# EAGLE design vewa-filters (EAGLE 6.6.0)
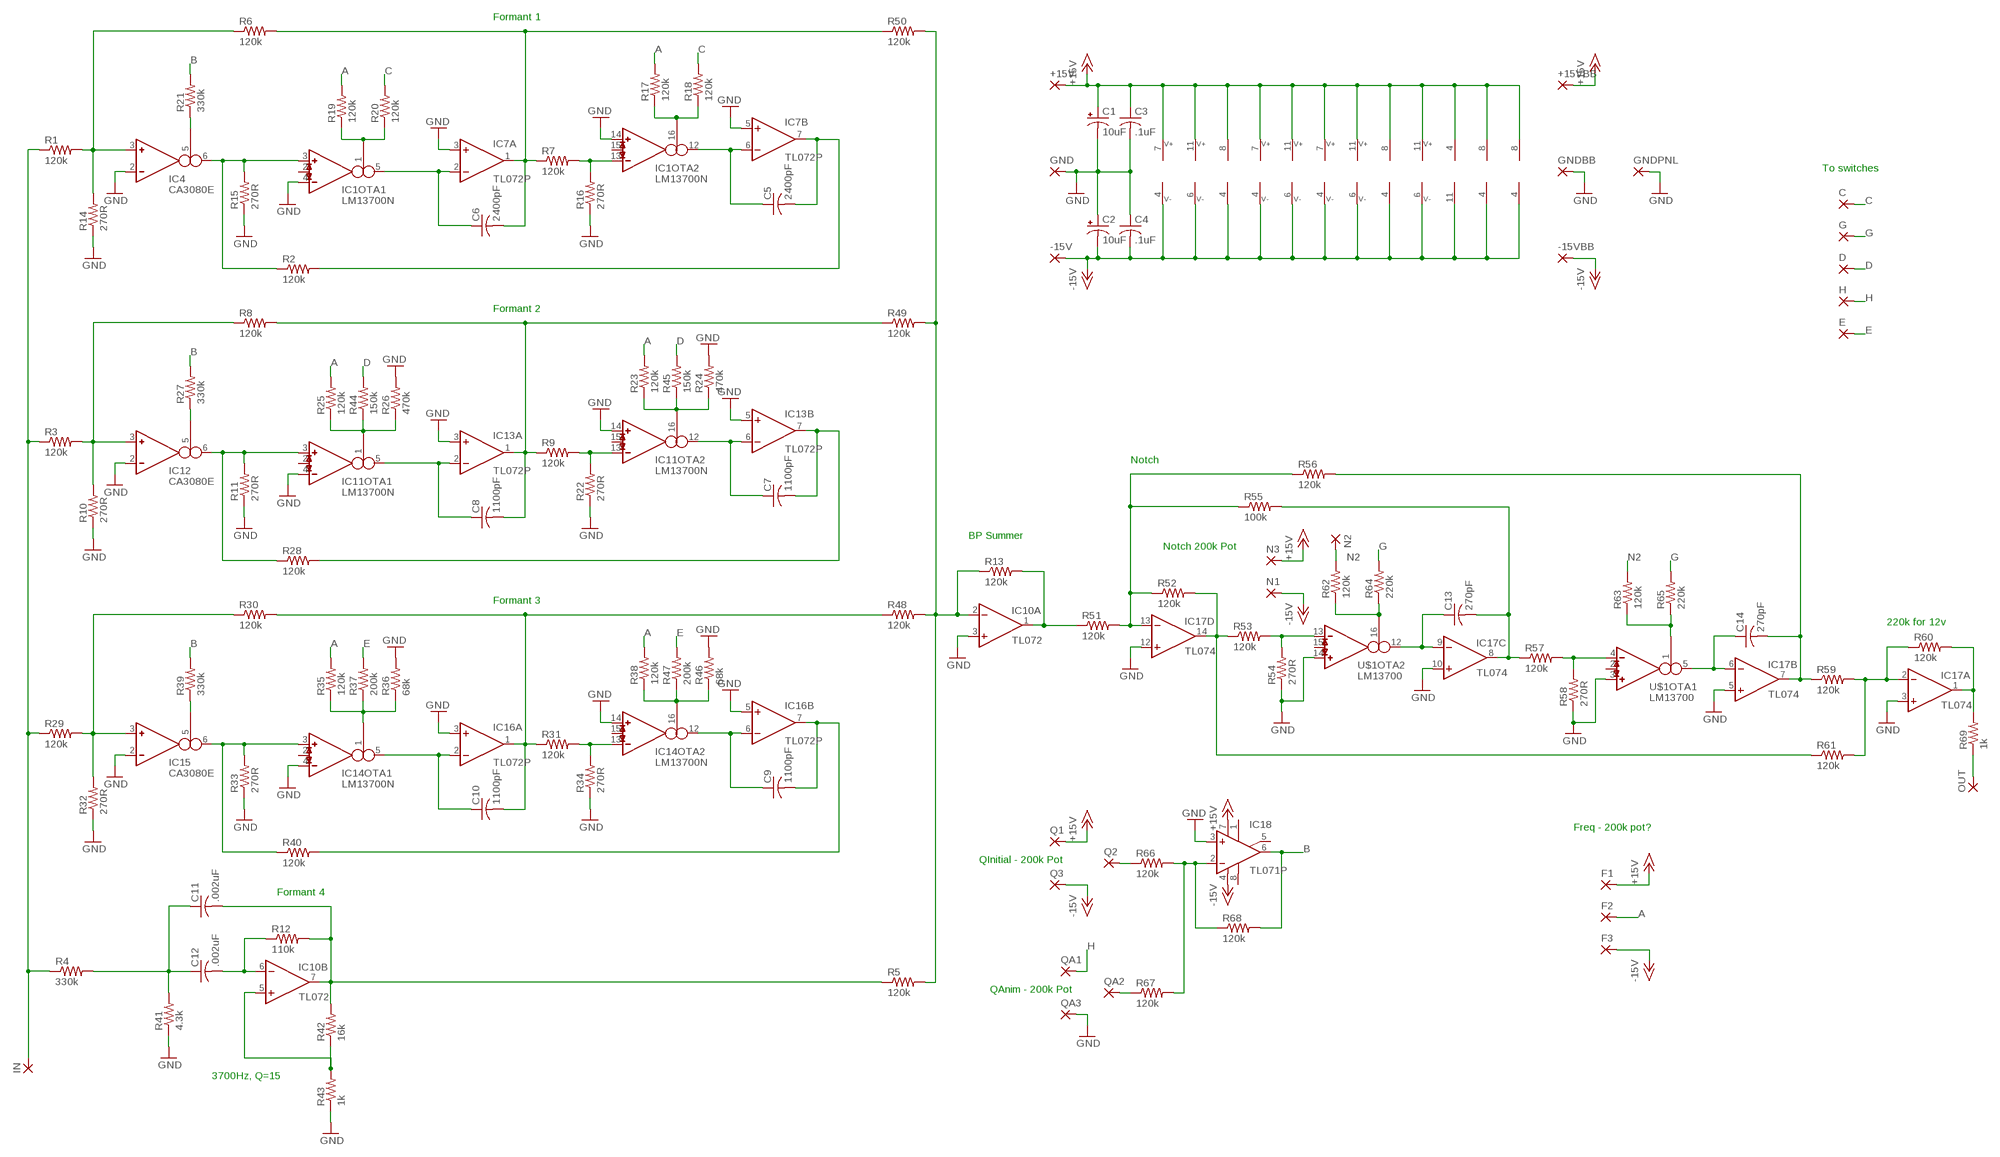
[diagram p0: schematic, sheet 1]

## Parts
+15V  2,54/1,0  [2,54/1,0]
+15VBB  2,54/1,0  [2,54/1,0]
-15V  2,54/1,0  [2,54/1,0]
-15VBB  2,54/1,0  [2,54/1,0]
C  2,54/1,0  [2,54/1,0]
C1  10uF  CPOL-USE2.5-5  [E2,5-5]
C2  10uF  CPOL-USE2.5-5  [E2,5-5]
C3  .1uF  C-US050-025X075  [C050-025X075]
C4  .1uF  C-US050-025X075  [C050-025X075]
C5  2400pF  C-US050-025X075  [C050-025X075]
C6  2400pF  C-US050-025X075  [C050-025X075]
C7  1100pF  C-US050-025X075  [C050-025X075]
C8  1100pF  C-US050-025X075  [C050-025X075]
C9  1100pF  C-US050-025X075  [C050-025X075]
C10  1100pF  C-US050-025X075  [C050-025X075]
C11  .002uF  C-US050-025X075  [C050-025X075]
C12  .002uF  C-US050-025X075  [C050-025X075]
C13  270pF  C-US050-025X075  [C050-025X075]
C14  270pF  C-US050-025X075  [C050-025X075]
D  2,54/1,0  [2,54/1,0]
E  2,54/1,0  [2,54/1,0]
F1  2,54/1,0  [2,54/1,0]
F2  2,54/1,0  [2,54/1,0]
F3  2,54/1,0  [2,54/1,0]
G  2,54/1,0  [2,54/1,0]
GND  2,54/1,0  [2,54/1,0]
GNDBB  2,54/1,0  [2,54/1,0]
GNDPNL  2,54/1,0  [2,54/1,0]
H  2,54/1,0  [2,54/1,0]
IC1  LM13700N  [DIL16]
IC4  CA3080E  [DIL08]
IC7  TL072P  [DIL08]
IC10  TL072  TL072-TOPP  [DIL08]
IC11  LM13700N  [DIL16]
IC12  CA3080E  [DIL08]
IC13  TL072P  [DIL08]
IC14  LM13700N  [DIL16]
IC15  CA3080E  [DIL08]
IC16  TL072P  [DIL08]
IC17  TL074  TL074-TOPP  [DIL14]
IC18  TL071P  [DIL08]
IN  2,54/1,0  [2,54/1,0]
N1  2,54/1,0  [2,54/1,0]
N2  2,54/1,0  [2,54/1,0]
N3  2,54/1,0  [2,54/1,0]
OUT  2,54/1,0  [2,54/1,0]
Q1  2,54/1,0  [2,54/1,0]
Q2  2,54/1,0  [2,54/1,0]
Q3  2,54/1,0  [2,54/1,0]
QA1  2,54/1,0  [2,54/1,0]
QA2  2,54/1,0  [2,54/1,0]
QA3  2,54/1,0  [2,54/1,0]
R1  120k  R-US_0207/10  [0207/10]
R2  120k  R-US_0207/10  [0207/10]
R3  120k  R-US_0207/10  [0207/10]
R4  330k  R-US_0207/10  [0207/10]
R5  120k  R-US_0207/10  [0207/10]
R6  120k  R-US_0207/10  [0207/10]
R7  120k  R-US_0207/10  [0207/10]
R8  120k  R-US_0207/10  [0207/10]
R9  120k  R-US_0207/10  [0207/10]
R10  270R  R-US_0207/10  [0207/10]
R11  270R  R-US_0207/10  [0207/10]
R12  110k  R-US_0207/10  [0207/10]
R13  120k  R-US_0207/10  [0207/10]
R14  270R  R-US_0207/10  [0207/10]
R15  270R  R-US_0207/10  [0207/10]
R16  270R  R-US_0207/10  [0207/10]
R17  120k  R-US_0207/10  [0207/10]
R18  120k  R-US_0207/10  [0207/10]
R19  120k  R-US_0207/10  [0207/10]
R20  120k  R-US_0207/10  [0207/10]
R21  330k  R-US_0207/10  [0207/10]
R22  270R  R-US_0207/10  [0207/10]
R23  120k  R-US_0207/10  [0207/10]
R24  470k  R-US_0207/10  [0207/10]
R25  120k  R-US_0207/10  [0207/10]
R26  470k  R-US_0207/10  [0207/10]
R27  330k  R-US_0207/10  [0207/10]
R28  120k  R-US_0207/10  [0207/10]
R29  120k  R-US_0207/10  [0207/10]
R30  120k  R-US_0207/10  [0207/10]
R31  120k  R-US_0207/10  [0207/10]
R32  270R  R-US_0207/10  [0207/10]
R33  270R  R-US_0207/10  [0207/10]
R34  270R  R-US_0207/10  [0207/10]
R35  120k  R-US_0207/10  [0207/10]
R36  68k  R-US_0207/10  [0207/10]
R37  200k  R-US_0207/10  [0207/10]
R38  120k  R-US_0207/10  [0207/10]
R39  330k  R-US_0207/10  [0207/10]
R40  120k  R-US_0207/10  [0207/10]
R41  4.3k  R-US_0207/10  [0207/10]
R42  16k  R-US_0207/10  [0207/10]
R43  1k  R-US_0207/10  [0207/10]
R44  150k  R-US_0207/10  [0207/10]
R45  150k  R-US_0207/10  [0207/10]
R46  68k  R-US_0207/10  [0207/10]
R47  200k  R-US_0207/10  [0207/10]
R48  120k  R-US_0207/10  [0207/10]
R49  120k  R-US_0207/10  [0207/10]
R50  120k  R-US_0207/10  [0207/10]
R51  120k  R-US_0207/10  [0207/10]
R52  120k  R-US_0207/10  [0207/10]
R53  120k  R-US_0207/10  [0207/10]
R54  270R  R-US_0207/10  [0207/10]
R55  100k  R-US_0207/10  [0207/10]
R56  120k  R-US_0207/10  [0207/10]
R57  120k  R-US_0207/10  [0207/10]
R58  270R  R-US_0207/10  [0207/10]
R59  120k  R-US_0207/10  [0207/10]
R60  120k  R-US_0207/10  [0207/10]
R61  120k  R-US_0207/10  [0207/10]
R62  120k  R-US_0207/10  [0207/10]
R63  120k  R-US_0207/10  [0207/10]
R64  220k  R-US_0207/10  [0207/10]
R65  220k  R-US_0207/10  [0207/10]
R66  120k  R-US_0207/10  [0207/10]
R67  120k  R-US_0207/10  [0207/10]
R68  120k  R-US_0207/10  [0207/10]
R69  1k  R-US_0207/10  [0207/10]
U$1  LM13700  LM13700-TOPDIP16  [DIL16]

## Nets
+15V: +15V.1(P) +15VBB.1(P) C1.+ C3.1 F1.1(P) IC1.11 IC4.7 IC7.8(P:V+) IC10.8(P:V+) IC11.11 IC12.7 IC13.8(P:V+) IC14.11 IC15.7 IC16.8(P:V+) IC17.4(P:V+) IC18.7(V+) N3.1(P) Q1.1(P) U$1.11
-15V: -15V.1(P) -15VBB.1(P) C2.- C4.2 F3.1(P) IC1.6 IC4.4 IC7.4(P:V-) IC10.4(P:V-) IC11.6 IC12.4 IC13.4(P:V-) IC14.6 IC15.4 IC16.4(P:V-) IC17.11(P:V-) IC18.4(V-) N1.1(P) Q3.1(P) U$1.6
A: F2.1(P) R17.2 R19.2 R23.2 R25.2 R35.2 R38.2
B: IC18.6(OUT) R21.2 R27.2 R39.2 R68.2
C: C.1(P) R18.2 R20.2
D: D.1(P) R44.2 R45.2
E: E.1(P) R37.2 R47.2
G: G.1(P) R64.2 R65.2
GND: C1.- C2.+ C3.2 C4.1 GND.1(P) GNDBB.1(P) GNDPNL.1(P) IC1.4(OTA1:IN_N) IC1.14(OTA2:IN_P) IC4.2(IN_N) IC7.3(A:+IN) IC7.5(B:+IN) IC10.3(A:+IN) IC11.4(OTA1:IN_N) IC11.14(OTA2:IN_P) IC12.2(IN_N) IC13.3(A:+IN) IC13.5(B:+IN) IC14.4(OTA1:IN_N) IC14.14(OTA2:IN_P) IC15.2(IN_N) IC16.3(A:+IN) IC16.5(B:+IN) IC17.3(A:+IN) IC17.5(B:+IN) IC17.10(C:+IN) IC17.12(D:+IN) IC18.3(+IN) QA3.1(P) R10.1 R11.1 R14.1 R15.1 R16.1 R22.1 R24.2 R26.2 R32.1 R33.1 R34.1 R36.2 R41.1 R43.1 R46.2 R54.1 R58.1 U$1.3(OTA1:IN_P) U$1.14(OTA2:IN_P)
H: H.1(P) QA1.1(P)
IN: IN.1(P) R1.1 R3.1 R4.1 R29.1
N2: N2.1(P) R62.2 R63.2
N$1: IC1.3(OTA1:IN_P) IC4.6(OUT) R2.1 R15.2
N$2: C6.1 IC1.5(OTA1:OUT) IC7.2(A:-IN)
N$3: IC4.3(IN_P) R1.2 R6.1 R14.2
N$4: IC4.5(I_BIAS) R21.1
N$5: IC1.13(OTA2:IN_N) R7.2 R16.2
N$6: C11.2 IC10.7(B:OUT) R5.1 R12.2 R42.2
N$7: C6.2 IC7.1(A:OUT) R6.2 R7.1 R50.1
N$8: OUT.1(P) R69.1
N$9: IC1.1(OTA1:I_BIAS) R19.1 R20.1
N$10: C5.1 IC1.12(OTA2:OUT) IC7.6(B:-IN)
N$11: C5.2 IC7.7(B:OUT) R2.2
N$12: IC1.16(OTA2:I_BIAS) R17.1 R18.1
N$13: IC11.3(OTA1:IN_P) IC12.6(OUT) R11.2 R28.1
N$14: C8.1 IC11.5(OTA1:OUT) IC13.2(A:-IN)
N$15: IC12.3(IN_P) R3.2 R8.1 R10.2
N$16: C8.2 IC13.1(A:OUT) R8.2 R9.1 R49.1
N$17: IC12.5(I_BIAS) R27.1
N$18: IC11.13(OTA2:IN_N) R9.2 R22.2
N$19: IC11.1(OTA1:I_BIAS) R25.1 R26.1 R44.1
N$20: IC14.1(OTA1:I_BIAS) R35.1 R36.1 R37.1
N$21: C7.1 IC11.12(OTA2:OUT) IC13.6(B:-IN)
N$22: C7.2 IC13.7(B:OUT) R28.2
N$23: IC14.16(OTA2:I_BIAS) R38.1 R46.1 R47.1
N$24: IC14.3(OTA1:IN_P) IC15.6(OUT) R33.2 R40.1
N$25: C10.1 IC14.5(OTA1:OUT) IC16.2(A:-IN)
N$26: IC15.3(IN_P) R29.2 R30.1 R32.2
N$27: C10.2 IC16.1(A:OUT) R30.2 R31.1 R48.1
N$28: IC15.5(I_BIAS) R39.1
N$29: IC14.13(OTA2:IN_N) R31.2 R34.2
N$30: IC17.13(D:-IN) R51.2 R52.1 R55.1 R56.1
N$31: IC17.14(D:OUT) R52.2 R53.1 R61.1
N$32: C9.1 IC14.12(OTA2:OUT) IC16.6(B:-IN)
N$33: C9.2 IC16.7(B:OUT) R40.2
N$34: R53.2 R54.2 U$1.13(OTA2:IN_N)
N$35: IC10.2(A:-IN) R5.2 R13.1 R48.2 R49.2 R50.2
N$36: IC10.1(A:OUT) R13.2 R51.1
N$37: C12.2 IC10.6(B:-IN) R12.1
N$38: IC10.5(B:+IN) R42.1 R43.2
N$39: C14.1 IC17.6(B:-IN) U$1.5(OTA1:OUT)
N$40: C14.2 IC17.7(B:OUT) R56.2 R59.1
N$41: C11.1 C12.1 R4.2 R41.2
N$42: C13.1 IC17.9(C:-IN) U$1.12(OTA2:OUT)
N$43: C13.2 IC17.8(C:OUT) R55.2 R57.1
N$44: R57.2 R58.2 U$1.4(OTA1:IN_N)
N$45: IC17.2(A:-IN) R59.2 R60.1 R61.2
N$46: IC17.1(A:OUT) R60.2 R69.2
N$47: Q2.1(P) R66.1
N$48: R62.1 R64.1 U$1.16(OTA2:I_BIAS)
N$49: IC18.2(-IN) R66.2 R67.2 R68.1
N$50: R63.1 R65.1 U$1.1(OTA1:I_BIAS)
N$52: QA2.1(P) R67.1
N$65: IC11.16(OTA2:I_BIAS) R23.1 R24.1 R45.1
Unconnected: IC1.2(OTA1:I_DIODE) IC1.7(BUF1:B) IC1.8(BUF1:E) IC1.9(BUF2:E) IC1.10(BUF2:B) IC1.15(OTA2:I_DIODE) IC11.2(OTA1:I_DIODE) IC11.7(BUF1:B) IC11.8(BUF1:E) IC11.9(BUF2:E) IC11.10(BUF2:B) IC11.15(OTA2:I_DIODE) IC14.2(OTA1:I_DIODE) IC14.7(BUF1:B) IC14.8(BUF1:E) IC14.9(BUF2:E) IC14.10(BUF2:B) IC14.15(OTA2:I_DIODE) IC18.1(ON1) IC18.5(ON2) IC18.8(OPT) U$1.2(OTA1:I_DIODE) U$1.7(BUF1:B) U$1.8(BUF1:E) U$1.9(BUF2:E) U$1.10(BUF2:B) U$1.15(OTA2:I_DIODE)

## Notes on the sheet
- Formant 1
- To switches
- Formant 2
- Notch
- BP Summer
- Notch 200k Pot
- Formant 3
- 220k for 12v
- Freq - 200k pot?
- QInitial - 200k Pot
- Formant 4
- QAnim - 200k Pot
- 3700Hz, Q=15

## Library data of the parts
+15V +15VBB -15V -15VBB C D E F1-F3 G GND GNDBB GNDPNL H IN N1-N3 OUT Q1-Q3 QA1-QA3 = wirepad:2,54/1,0: THROUGH-HOLE PAD
C1 C2 = rcl:CPOL-US: POLARIZED CAPACITOR, American symbol
C3-C14 = rcl:C-US: CAPACITOR, American symbol
IC1 IC11 IC14 = mmoretti:LM13700: Dual OTA with buffers
IC4 IC12 IC15 = mmoretti:CA3080: OTA
IC7 IC13 IC16 = mmoretti:TL072: OP AMP
IC10 = mmoretti:TL072-TOP: OP AMP
IC17 = mmoretti:TL074-TOP: OP AMP
IC18 = mmoretti:TL071: OP AMP
R1-R69 = rcl:R-US_: RESISTOR, American symbol
U$1 = mmoretti:LM13700-TOP

## Board
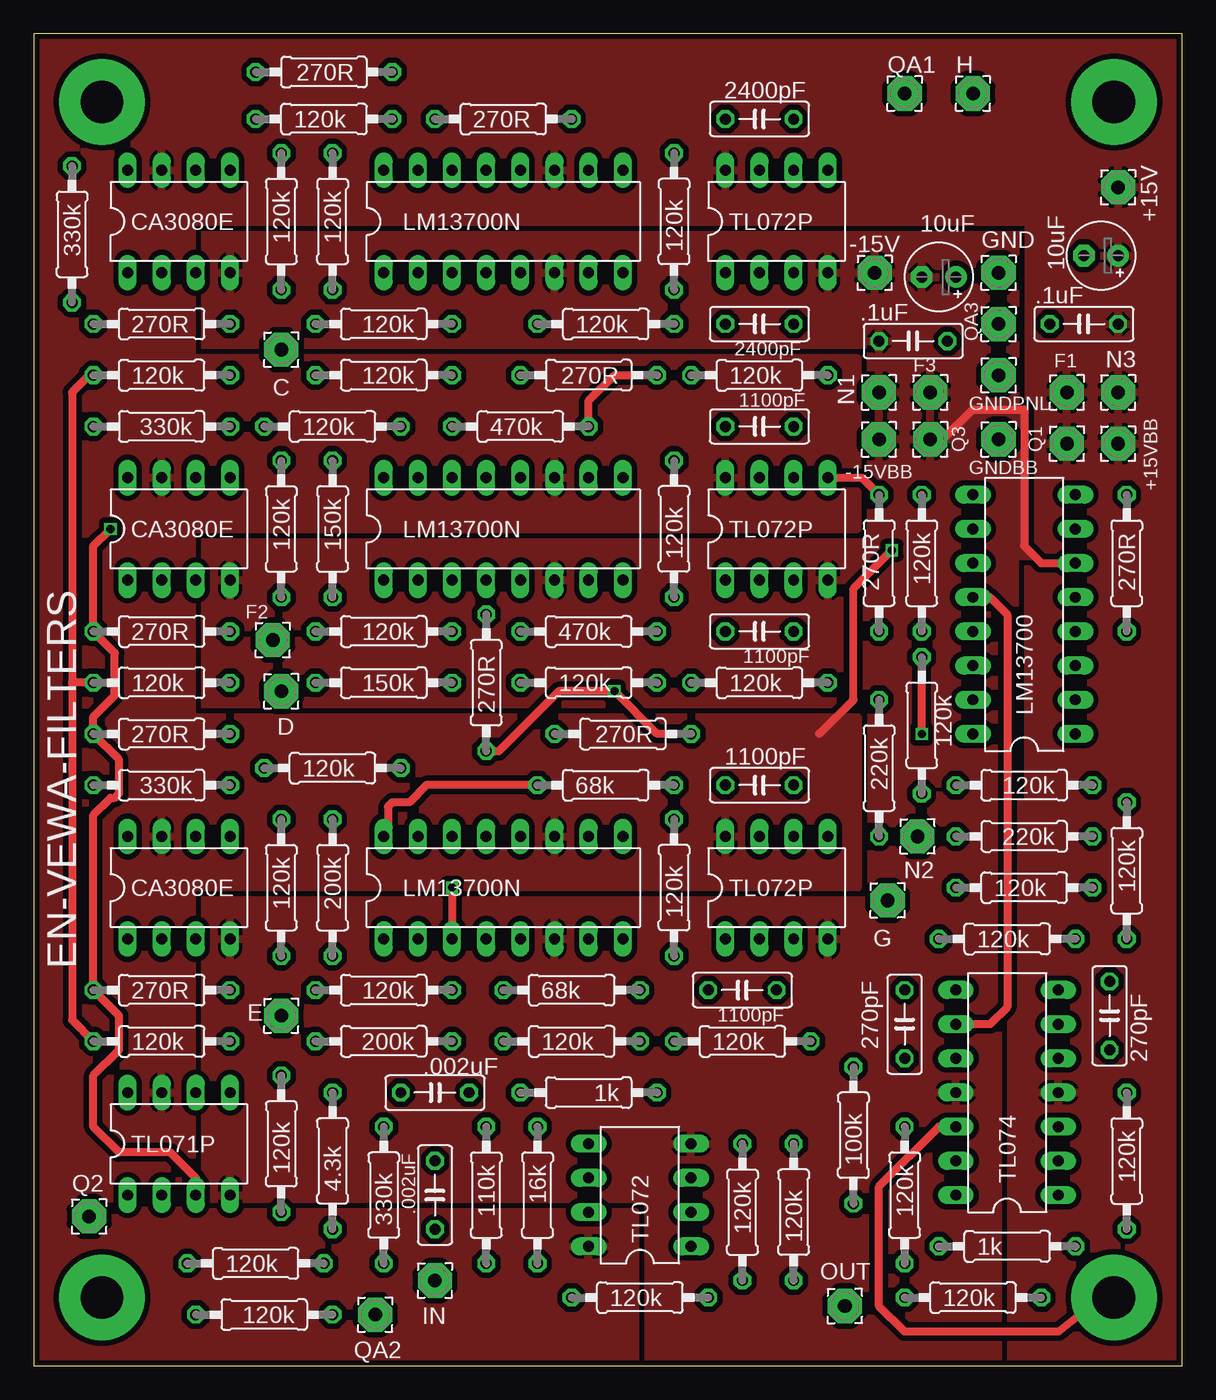
[diagram p1: board, top side]
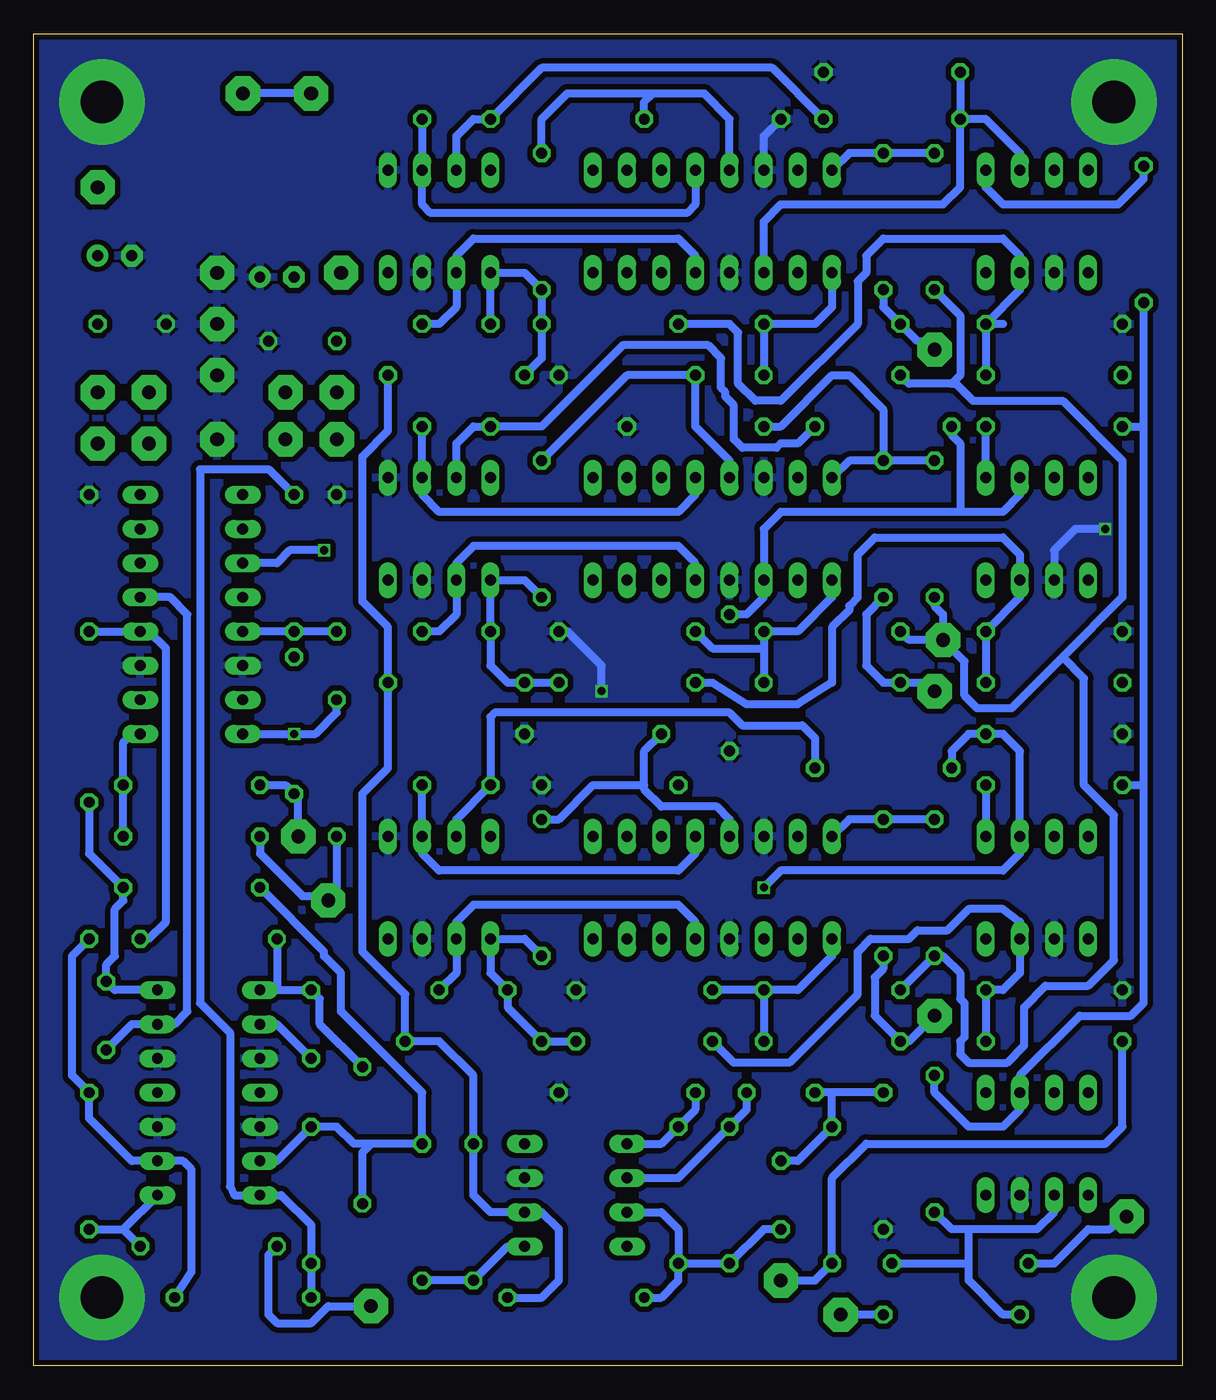
[diagram p2: board, bottom side, seen from below]

Size 85.41 x 99.06 mm. Coordinates in mm from the lower left corner, seen from the top.
Outline: 0,0 85.41,0 85.41,99.06 0,99.06 0,0
Copper layers (1*16): Top 0.035mm / dielectric 1.5mm / Bottom 0.035mm
Design rules "SeeedStudio_2layer_DRU_no_angle_20140221": minimum track width 6mil, minimum drill 12mil, track to track 6mil, track to pad 6mil, pad to pad 6mil, via to via 6mil, smd to smd 0mil, copper to edge 10mil, drill to drill 10mil, minimum pad ring 10mil, minimum via ring 6mil, stop-mask expansion 2mil, vias tented up to drill 100mil, thermal gap 10mil

### Footprints (pad centres in the part's own frame; a part is rotated, then mirrored left to right if it is on the bottom)
2,54/1,0 = drill 1.016 pad 2.54 octagon: 1 0,0
E2,5-5 = drill 0.813 pad 1.6: + -1.27,0 | drill 0.813 pad 1.6 octagon: - 1.27,0
C050-025X075 = drill 0.813 octagon: 1 -2.54,0; 2 2.54,0
DIL16 = drill 0.813 long: 1 -8.89,-3.81; 2 -6.35,-3.81; 3 -3.81,-3.81; 4 -1.27,-3.81; 5 1.27,-3.81; 6 3.81,-3.81; 7 6.35,-3.81; 8 8.89,-3.81; 9 8.89,3.81; 10 6.35,3.81; 11 3.81,3.81; 12 1.27,3.81; 13 -1.27,3.81; 14 -3.81,3.81; 15 -6.35,3.81; 16 -8.89,3.81
DIL08 = drill 0.813 long: 1 -3.81,-3.81; 2 -1.27,-3.81; 3 1.27,-3.81; 4 3.81,-3.81; 5 3.81,3.81; 6 1.27,3.81; 7 -1.27,3.81; 8 -3.81,3.81
DIL14 = drill 0.813 long: 1 -7.62,-3.81; 2 -5.08,-3.81; 3 -2.54,-3.81; 4 0,-3.81; 5 2.54,-3.81; 6 5.08,-3.81; 7 7.62,-3.81; 8 7.62,3.81; 9 5.08,3.81; 10 2.54,3.81; 11 0,3.81; 12 -2.54,3.81; 13 -5.08,3.81; 14 -7.62,3.81
0207/10 = drill 0.813 octagon: 1 -5.08,0; 2 5.08,0

### Placement (x,y rotation side)
+15V  80.64,87.63 0 top
+15VBB  80.64,68.58 0 top
-15V  62.55,81.28 0 top
-15VBB  62.87,68.9 0 top
C  18.41,75.56 0 top
C1  79.38,82.55 180 top
C2  67.31,80.96 180 top
C3  78.11,77.47 180 top
C4  65.41,76.2 180 top
C5  53.98,92.71 180 top
C6  53.98,77.47 180 top
C7  53.98,69.85 180 top
C8  53.98,54.61 180 top
C9  53.98,43.18 180 top
C10  52.7,27.94 180 top
C11  29.84,12.7 270 top
C12  29.84,20.32 0 top
C13  64.77,25.4 90 top
C14  80.01,26.04 90 top
D  18.41,50.16 0 top
E  18.41,26.04 0 top
F1  76.83,72.39 0 top
F2  17.78,53.98 0 top
F3  66.67,72.39 0 top
G  63.5,34.61 90 top
GND  71.75,81.28 0 top
GNDBB  71.75,68.9 0 top
GNDPNL  71.75,73.66 0 top
H  69.85,94.61 0 top
IC1  34.92,85.09 0 top
IC4  10.79,85.09 0 top
IC7  55.24,85.09 0 top
IC10  45.09,12.7 90 top
IC11  34.92,62.23 0 top
IC12  10.79,62.23 0 top
IC13  55.24,62.23 0 top
IC14  34.92,35.56 0 top
IC15  10.79,35.56 0 top
IC16  55.24,35.56 0 top
IC17  72.39,20.32 90 top
IC18  10.79,16.51 0 top
IN  29.84,6.35 0 top
N1  62.87,72.39 0 top
N2  65.72,39.37 90 top
N3  80.64,72.39 0 top
OUT  60.33,4.45 90 top
Q1  76.83,68.58 0 top
Q2  4.13,11.11 0 top
Q3  66.67,68.9 0 top
QA1  64.77,94.61 0 top
QA2  25.4,3.81 0 top
QA3  71.75,77.47 0 top
R1  9.53,73.66 0 top
R2  21.59,92.71 0 top
R3  9.53,50.8 0 top
R4  26.04,12.7 90 top
R5  45.09,5.08 0 top
R6  42.55,77.47 0 top
R7  47.62,85.09 90 top
R8  41.27,50.8 0 top
R9  47.62,62.23 90 top
R10  9.53,54.61 0 top
R11  33.66,50.8 90 top
R12  33.66,12.7 270 top
R13  52.7,11.43 270 top
R14  9.53,77.47 0 top
R15  21.59,96.2 180 top
R16  34.92,92.71 0 top
R17  18.41,85.09 270 top
R18  22.23,85.09 270 top
R19  26.04,73.66 180 top
R20  26.04,77.47 180 top
R21  2.86,84.14 270 top
R22  41.27,73.66 180 top
R23  18.41,62.23 270 top
R24  36.2,69.85 0 top
R25  26.04,54.61 180 top
R26  41.27,54.61 0 top
R27  9.53,69.85 180 top
R28  22.23,69.85 0 top
R29  9.53,24.13 0 top
R30  40.01,24.13 0 top
R31  47.62,35.56 90 top
R32  9.53,27.94 0 top
R33  9.53,46.99 0 top
R34  43.81,46.99 180 top
R35  26.04,27.94 180 top
R36  40.01,27.94 0 top
R37  26.04,24.13 180 top
R38  18.41,35.56 270 top
R39  9.53,43.18 180 top
R40  22.23,44.45 0 top
R41  22.23,15.24 90 top
R42  37.47,12.7 270 top
R43  41.27,20.32 180 top
R44  26.04,50.8 180 top
R45  22.23,62.23 270 top
R46  42.55,43.18 0 top
R47  22.23,35.56 270 top
R48  52.7,24.13 0 top
R49  53.98,50.8 0 top
R50  53.98,73.66 0 top
R51  56.52,11.43 90 top
R52  64.77,12.7 270 top
R53  66.04,59.69 270 top
R54  62.87,59.69 270 top
R55  60.96,17.14 90 top
R56  73.66,35.56 0 top
R57  72.39,31.75 0 top
R58  81.28,59.69 270 top
R59  81.28,36.83 270 top
R60  81.28,15.24 270 top
R61  69.85,5.08 0 top
R62  66.04,47.62 270 top
R63  73.66,43.18 180 top
R64  62.87,44.45 270 top
R65  73.66,39.37 180 top
R66  16.51,7.62 0 top
R67  17.14,3.81 180 top
R68  18.41,16.51 90 top
R69  72.39,8.89 0 top
U$1  73.66,55.88 90 top

### Tracks (layer width: path | path; a pad name or v marks a point on that pad's centre or on a via)
+15V  (via drill 0.6)
  Top 0.61: 58.42,46.99 60.96,49.53 60.96,57.78 v63.82,60.64
  Bottom 0.61: v63.82,60.64 66.36,60.64 67.31,59.69 U$1.11
  pour Top (isolate 0.406): 0,85.09 73.98,85.09 73.98,66.04 85.41,66.04 85.41,99.06 0,99.06
  pour Top (isolate 0.406): 85.41,66.04 85.41,0 72.71,0 72.71,41.91 73.98,41.91 73.98,66.04
  pour Top (isolate 0.406): 0,85.09 11.75,85.09 11.75,0 0,0
  pour Top (isolate 0.406): 11.75,62.23 61.28,62.23 61.28,74.93 11.75,74.93
  pour Top (isolate 0.406): 11.75,48.26 61.28,48.26 61.28,35.56 11.75,35.56
  pour Top (isolate 0.406): 11.75,0 44.77,0 44.77,11.43 11.75,11.43
-15V
  Top 0.61: Q3.1 67.63,68.9 69.85,71.12 73.66,71.12 73.66,60.96 74.93,59.69 U$1.6
  pour Top (isolate 0.406, rank 2): 11.75,85.09 73.98,85.09 73.98,66.04 61.28,66.04 61.28,74.93 11.75,74.93
  pour Top (isolate 0.406, rank 2): 61.28,66.04 61.28,0 72.71,0 72.71,41.91 73.98,41.91 73.98,66.04
  pour Top (isolate 0.406, rank 2): 11.75,62.23 61.28,62.23 61.28,48.26 11.75,48.26
  pour Top (isolate 0.406, rank 2): 11.75,35.56 61.28,35.56 61.28,0 44.77,0 44.77,11.43 11.75,11.43
A
  Bottom 0.61: R17.2 16.51,78.11 16.51,73.66 17.14,73.03 | 17.14,73.03 20.32,73.03 R19.2 | R23.2 18.41,56.52 17.78,55.88 F2.1 | F2.1 20.32,53.98 R25.2 | R35.2 R38.2 17.78,30.48 16.51,29.21 16.51,27.3 16.19,26.99 16.19,24.45 16.51,24.13 16.51,23.18 15.88,22.54 13.02,22.54 11.75,23.81 11.75,26.67 10.16,28.26 6.99,28.26 5.08,30.16 5.08,40.96 7.3,43.18 7.3,51.12 8.89,52.7 | 17.14,73.03 16.83,73.03 15.56,71.75 8.89,71.75 4.45,67.31 4.45,57.15 8.89,52.7 | 8.89,52.7 12.7,48.9 15.24,48.9 16.19,49.85 16.19,52.39 F2.1
B
  Bottom 0.61: R68.2 18.41,20.32 15.88,17.78 13.34,17.78 12.06,19.05 IC18.6 12.06,21.59 7.62,26.04 3.81,26.04 2.86,26.99 2.86,43.18 | 2.86,43.18 2.86,69.85 | 2.86,69.85 R21.2 | R39.2 2.86,43.18 | R27.2 2.86,69.85
C
  Bottom 0.61: R18.2 22.23,78.74 R20.2 19.68,76.2 19.05,76.2 C.1
D
  Bottom 0.61: R45.2 23.5,55.88 23.5,52.07 22.23,50.8 R44.2 19.05,50.8 D.1
E
  Bottom 0.61: E.1 20.32,24.13 R37.2 22.86,26.04 22.86,28.89 22.23,29.53 R47.2
G
  Bottom 0.61: R65.2 68.58,38.1 65.41,34.92 63.82,34.92 G.1 62.87,35.24 R64.2
GND  (via drill 0.6, 3.17 pad 6.35)
  Top 0.61: v80.33,5.08 79.38,5.08 76.2,2.54 64.77,2.54 62.87,4.45 62.87,13.34 67.31,17.78 IC17.12 | IC18.3 12.06,13.97 10.16,15.88 6.35,15.88 4.45,17.78 4.45,21.59 6.35,23.5 6.35,26.04 R32.1 4.45,40.96 5.71,42.23 6.03,42.23 6.35,42.55 6.35,45.09 R33.1 4.45,48.26 6.03,49.85 6.03,53.02 R10.1 4.45,60.96 v5.71,62.23 | R24.2 41.27,71.75 43.18,73.66 R22.1 | R34.1 46.35,46.99 v43.18,50.16 39.05,50.16 34.61,45.72 R11.1 | IC13.5 61.59,66.04 R54.1
  Bottom 0.61: IC1.14 31.11,91.44 R16.1 | v5.71,62.23 7.94,62.23 9.53,60.64 IC12.2 | v43.18,50.16 43.18,52.07 45.72,54.61 R26.2
  other vias: 5.08,93.98 80.33,93.98 5.08,5.08
  pour Bottom (isolate 0.406): 0,99.06 85.41,99.06 85.41,0 0,0
H
  Bottom 0.61: QA1.1 H.1
IN
  Top 0.61: R1.1 4.13,73.66 2.86,72.39 2.86,50.8 | 2.86,50.8 2.86,25.72 R29.1 | R3.1 2.86,50.8
  Bottom 0.61: IN.1 27.3,6.35 R4.1 26.04,13.97 23.5,16.51 5.71,16.51 4.45,17.78 R29.1
N2
  Bottom 0.61: N2.1 65.72,42.23 R62.2 66.67,43.18 R63.2
N$1
  Bottom 0.61: R15.2 R2.1 | IC4.6 12.06,90.17 14.61,92.71 R2.1 | IC1.3 31.11,85.09 29.84,86.36 17.78,86.36 16.51,87.63 R2.1
N$2
  Bottom 0.61: IC1.5 36.2,82.55 37.47,83.82 52.7,83.82 53.98,82.55 IC7.2 53.98,78.74 55.24,77.47 C6.1
N$3
  Bottom 0.61: 13.34,77.47 R14.2 | R14.2 R1.2 | R6.1 33.66,77.47 33.02,76.83 33.02,73.03 31.75,71.75 29.84,71.75 24.13,77.47 24.13,80.64 23.5,81.28 23.5,82.55 22.23,83.82 13.34,83.82 12.06,82.55 IC4.3 12.06,80.01 R14.2
N$4
  Bottom 0.61: IC4.5 14.61,87.63 13.34,86.36 4.76,86.36 2.86,88.27 R21.1
N$5
  Bottom 0.61: R7.2 47.62,92.71 45.72,94.61 39.37,94.61 | 39.37,94.61 35.56,94.61 33.66,92.71 IC1.13 | R16.2 40.01,93.98 39.37,94.61
N$6
  Bottom 0.61: IC10.7 38.73,11.43 37.47,10.16 R42.2 | R5.1 38.73,5.08 37.47,6.35 R42.2 | R42.2 R12.2 31.11,10.16 C11.2
N$7
  Bottom 0.61: C6.2 IC7.1 48.9,81.28 R7.1 R6.2 47.62,74.93 R50.1
N$8
  Bottom 0.61: R69.1 67.94,8.26 67.94,3.81 67.31,3.17 64.77,3.17 63.5,4.45 OUT.1
N$9
  Bottom 0.61: IC1.1 26.04,78.74 27.3,77.47 R20.1 R19.1
N$10
  Bottom 0.61: C5.1 IC7.6 56.52,86.36 55.88,85.72 36.83,85.72 36.2,86.36 IC1.12
N$11
  Bottom 0.61: IC7.7 53.98,91.44 52.7,92.71 C5.2 47.62,96.52 30.48,96.52 R2.2
N$12
  Bottom 0.61: R17.1 R18.1 24.77,90.17 IC1.16
N$13
  Bottom 0.61: R28.1 17.14,69.22 16.51,68.58 16.51,63.5 | 16.51,63.5 13.34,63.5 12.06,64.77 IC12.6 | 16.51,63.5 29.84,63.5 31.11,62.23 IC11.3 31.11,57.15 32.38,55.88 R11.2
N$14
  Bottom 0.61: IC11.5 36.2,59.69 37.47,60.96 52.7,60.96 53.98,59.69 IC13.2 53.98,55.88 55.24,54.61 C8.1
N$15
  Bottom 0.61: R8.1 34.92,50.8 32.38,49.21 28.57,49.21 26.04,50.8 26.04,54.93 24.77,56.2 24.77,56.52 24.13,57.15 24.13,60.33 22.86,61.59 13.34,61.59 12.06,60.33 IC12.3 12.06,57.15 R10.2 R3.2
N$16
  Bottom 0.61: R9.1 48.9,58.42 IC13.1 C8.2 51.44,52.07 50.16,50.8 R49.1 R8.2
N$17
  Bottom 0.61: IC12.5 R27.1
N$18
  Bottom 0.61: IC11.13 33.66,67.31 36.2,69.85 R22.2 41.27,73.66 R9.2
N$19
  Bottom 0.61: IC11.1 26.04,57.15 28.57,54.61 R25.1 31.11,53.34 | 31.11,53.34 R44.1 | R26.1 34.92,53.34 31.11,53.34
N$20
  Bottom 0.61: IC14.1 26.04,30.48 28.57,27.94 R35.1 | R35.1 R36.1 | R35.1 R37.1
N$21
  Bottom 0.61: IC11.12 36.2,64.77 37.47,63.5 55.24,63.5 56.52,64.77 IC13.6 C7.1
N$22
  Bottom 0.61: R28.2 28.57,68.58 29.84,68.58 30.16,68.26 32.7,68.26 33.34,68.9 33.34,71.44 33.97,72.07 33.97,72.39 34.29,72.71 34.29,74.93 35.24,75.88 41.59,75.88 47.62,69.85 C7.2 52.7,69.85 53.98,68.58 IC13.7
N$23
  Top 0.61: R46.1 29.21,43.18 27.94,41.91 26.67,41.91 26.35,41.59 26.35,39.69 IC14.16
  Bottom 0.61: R38.1 R47.1 24.77,40.64 IC14.16
N$24  (via drill 0.6)
  Top 0.61: v31.11,35.56 IC14.3
  Bottom 0.61: R40.1 17.14,45.72 15.88,46.99 R33.2 13.34,46.99 12.06,45.72 IC15.6 12.06,38.1 13.34,36.83 29.84,36.83 v31.11,35.56
N$25
  Bottom 0.61: IC14.5 36.2,33.02 37.47,34.29 52.7,34.29 53.98,33.02 IC16.2 53.98,29.21 C10.1
N$26
  Bottom 0.61: R29.2 R32.2 13.34,27.94 12.06,29.21 IC15.3 12.06,33.02 13.34,33.97 15.88,33.97 17.3,32.54 17.46,32.38 19.68,32.38 20.32,31.75 23.18,31.75 24.13,30.8 24.13,27.62 29.21,22.54 33.34,22.54 R30.1
N$27
  Bottom 0.61: R31.1 48.9,31.75 IC16.1 51.44,29.21 C10.2 50.16,26.67 R48.1 R30.2
N$28
  Bottom 0.61: R39.1 IC15.5
N$29
  Bottom 0.61: IC14.13 33.66,40.64 34.61,41.59 38.73,41.59 40.01,42.86 40.01,43.18 | 40.01,43.18 40.01,45.72 R34.2 | R31.2 46.35,40.64 43.81,43.18 40.01,43.18
N$30
  Bottom 0.61: IC17.13 67.31,15.24 R52.1 62.87,17.78 61.59,16.51 60.33,16.51 | 60.33,16.51 R51.2 56.52,20.32 62.55,26.35 62.55,29.21 63.82,30.48 63.82,30.8 R56.1 | R55.1 60.96,15.88 60.33,16.51
N$31
  Bottom 0.61: R61.1 R52.2 64.77,10.48 66.99,12.7 IC17.14 70.48,12.7 70.8,13.34 70.8,24.77 73.03,26.99 73.03,66.67 67.94,66.67 R53.1
N$32
  Bottom 0.61: IC14.12 36.2,38.1 37.47,36.83 55.24,36.83 56.52,38.1 IC16.6 C9.1
N$33
  Bottom 0.61: IC16.7 53.98,40.64 C9.2 51.44,48.26 51.12,48.58 33.66,48.58 32.7,47.62 28.26,47.62 27.3,46.67 R40.2
N$34
  Bottom 0.61: R54.2 R53.2 U$1.13
N$35
  Bottom 0.61: R5.2 47.62,5.08 46.35,6.35 46.35,10.16 47.62,11.43 IC10.2 51.44,11.43 52.7,12.7 R13.1 52.7,21.59 55.24,24.13 R48.2 57.78,27.62 60.96,30.8 60.96,42.55 59.05,44.45 R49.2 59.05,54.93 60.96,56.83 60.96,67.63 59.05,69.53 R50.2
N$36
  Bottom 0.61: IC10.1 50.16,8.89 R13.2 R51.1
N$37
  Bottom 0.61: C12.2 32.38,19.05 R12.1 37.47,13.97 IC10.6
N$38
  Bottom 0.61: IC10.5 38.73,16.51 R42.1 36.2,19.05 R43.2
N$39
  Bottom 0.61: C14.1 78.11,25.4 IC17.6 74.93,25.4 73.98,26.35 73.98,55.88 75.25,57.15 U$1.5
N$40
  Bottom 0.61: IC17.7 79.38,27.94 C14.2 80.01,29.84 79.38,30.48 79.38,33.97 78.74,34.61 R56.2 81.28,38.1 R59.1
N$41
  Bottom 0.61: R41.2 26.04,20.32 | 26.04,20.32 C12.1 | 26.04,20.32 R4.2 28.57,15.24 C11.1
N$42
  Top 0.61: U$1.12 71.12,57.15 72.39,55.88 72.39,26.67 71.12,25.4 IC17.9
  Bottom 0.61: IC17.9 67.31,25.4 C13.1
N$43
  Bottom 0.61: IC17.8 67.31,27.94 | 67.31,27.94 C13.2 64.14,27.3 64.14,25.4 R55.2 | R57.1 67.31,27.94
N$44
  Bottom 0.61: R58.2 U$1.4 76.83,54.61 75.56,53.34 75.56,33.02 76.83,31.75 R57.2
N$45
  Bottom 0.61: R61.2 73.66,6.99 73.66,14.61 74.3,15.24 IC17.2 78.11,15.24 81.28,18.41 R60.1 82.55,21.59 82.55,30.48 R59.2
N$46
  Bottom 0.61: R60.2 78.74,10.16 | 78.74,10.16 R69.2 | IC17.1 78.74,10.16
N$47
  Bottom 0.61: R66.1 9.53,7.62 6.99,10.16 5.4,10.16 Q2.1
N$48  (via drill 0.6)
  Top 0.61: v66.04,46.99 R62.1
  Bottom 0.61: U$1.16 v66.04,46.99 64.45,46.99 62.87,48.58 R64.1
N$49
  Bottom 0.61: IC18.2 9.53,11.43 10.79,10.16 15.88,10.16 | 15.88,10.16 17.14,10.16 R68.1 | R67.2 13.34,3.81 15.88,6.35 15.88,7.62 | 15.88,7.62 15.88,10.16 | R66.2 15.88,7.62
N$50
  Bottom 0.61: R65.1 R63.1 78.74,46.35 78.11,46.99 U$1.1
N$52
  Bottom 0.61: R67.1 QA2.1
N$65
  Bottom 0.61: R23.1 R45.1 | R45.1 24.77,67.31 IC11.16 | R24.1 29.84,69.85 26.04,73.66 24.77,73.66 22.23,71.12 R45.1

### Text on the board
tNames: EN-VEWA-FILTERS